# EasyEDA Pro project SWM34SVE.eprj

# Schematic SWM34SVE

## Sheets
1 Core: Create Date: 2023-02-07; Page Name: Core; Project Name: SWM34SVE; Schematic Name: SWM34SVE; Update Date: 2023-07-17; Company: Synwit; Page Size: A4; Version: V1.0
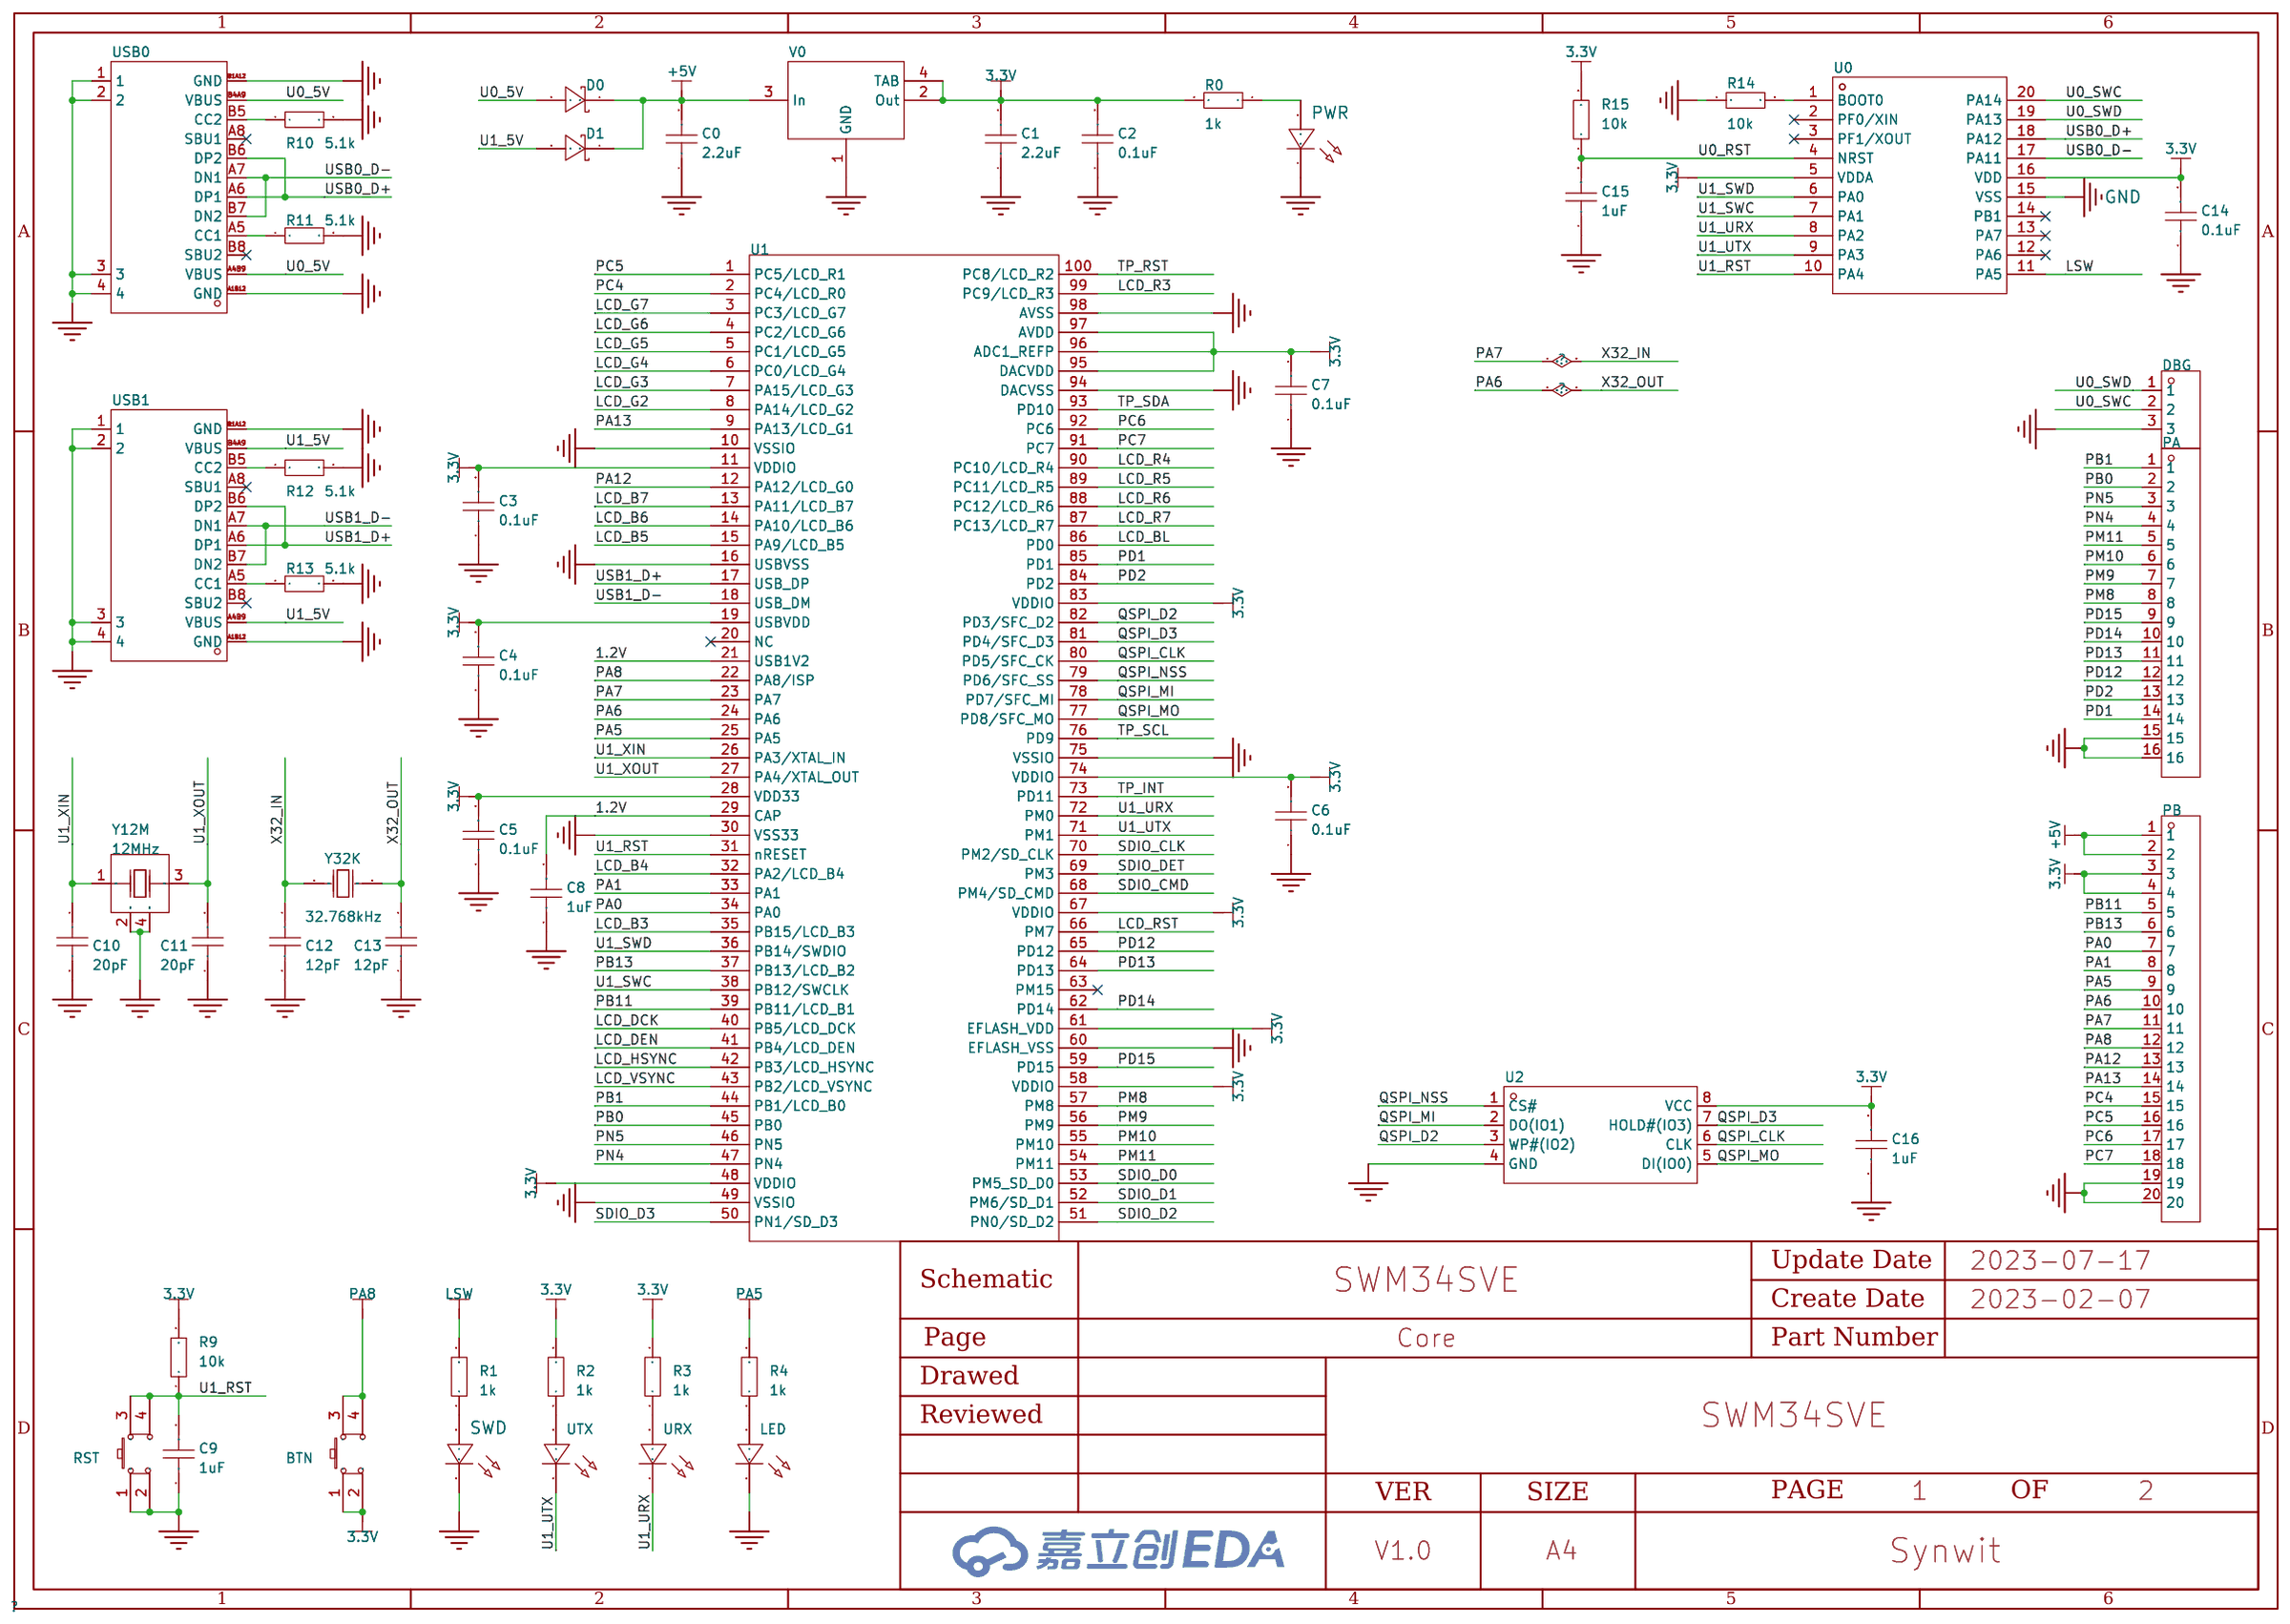
[diagram p0: Core]
2 Other: Page Name: Other; Update Date: 2023-07-14
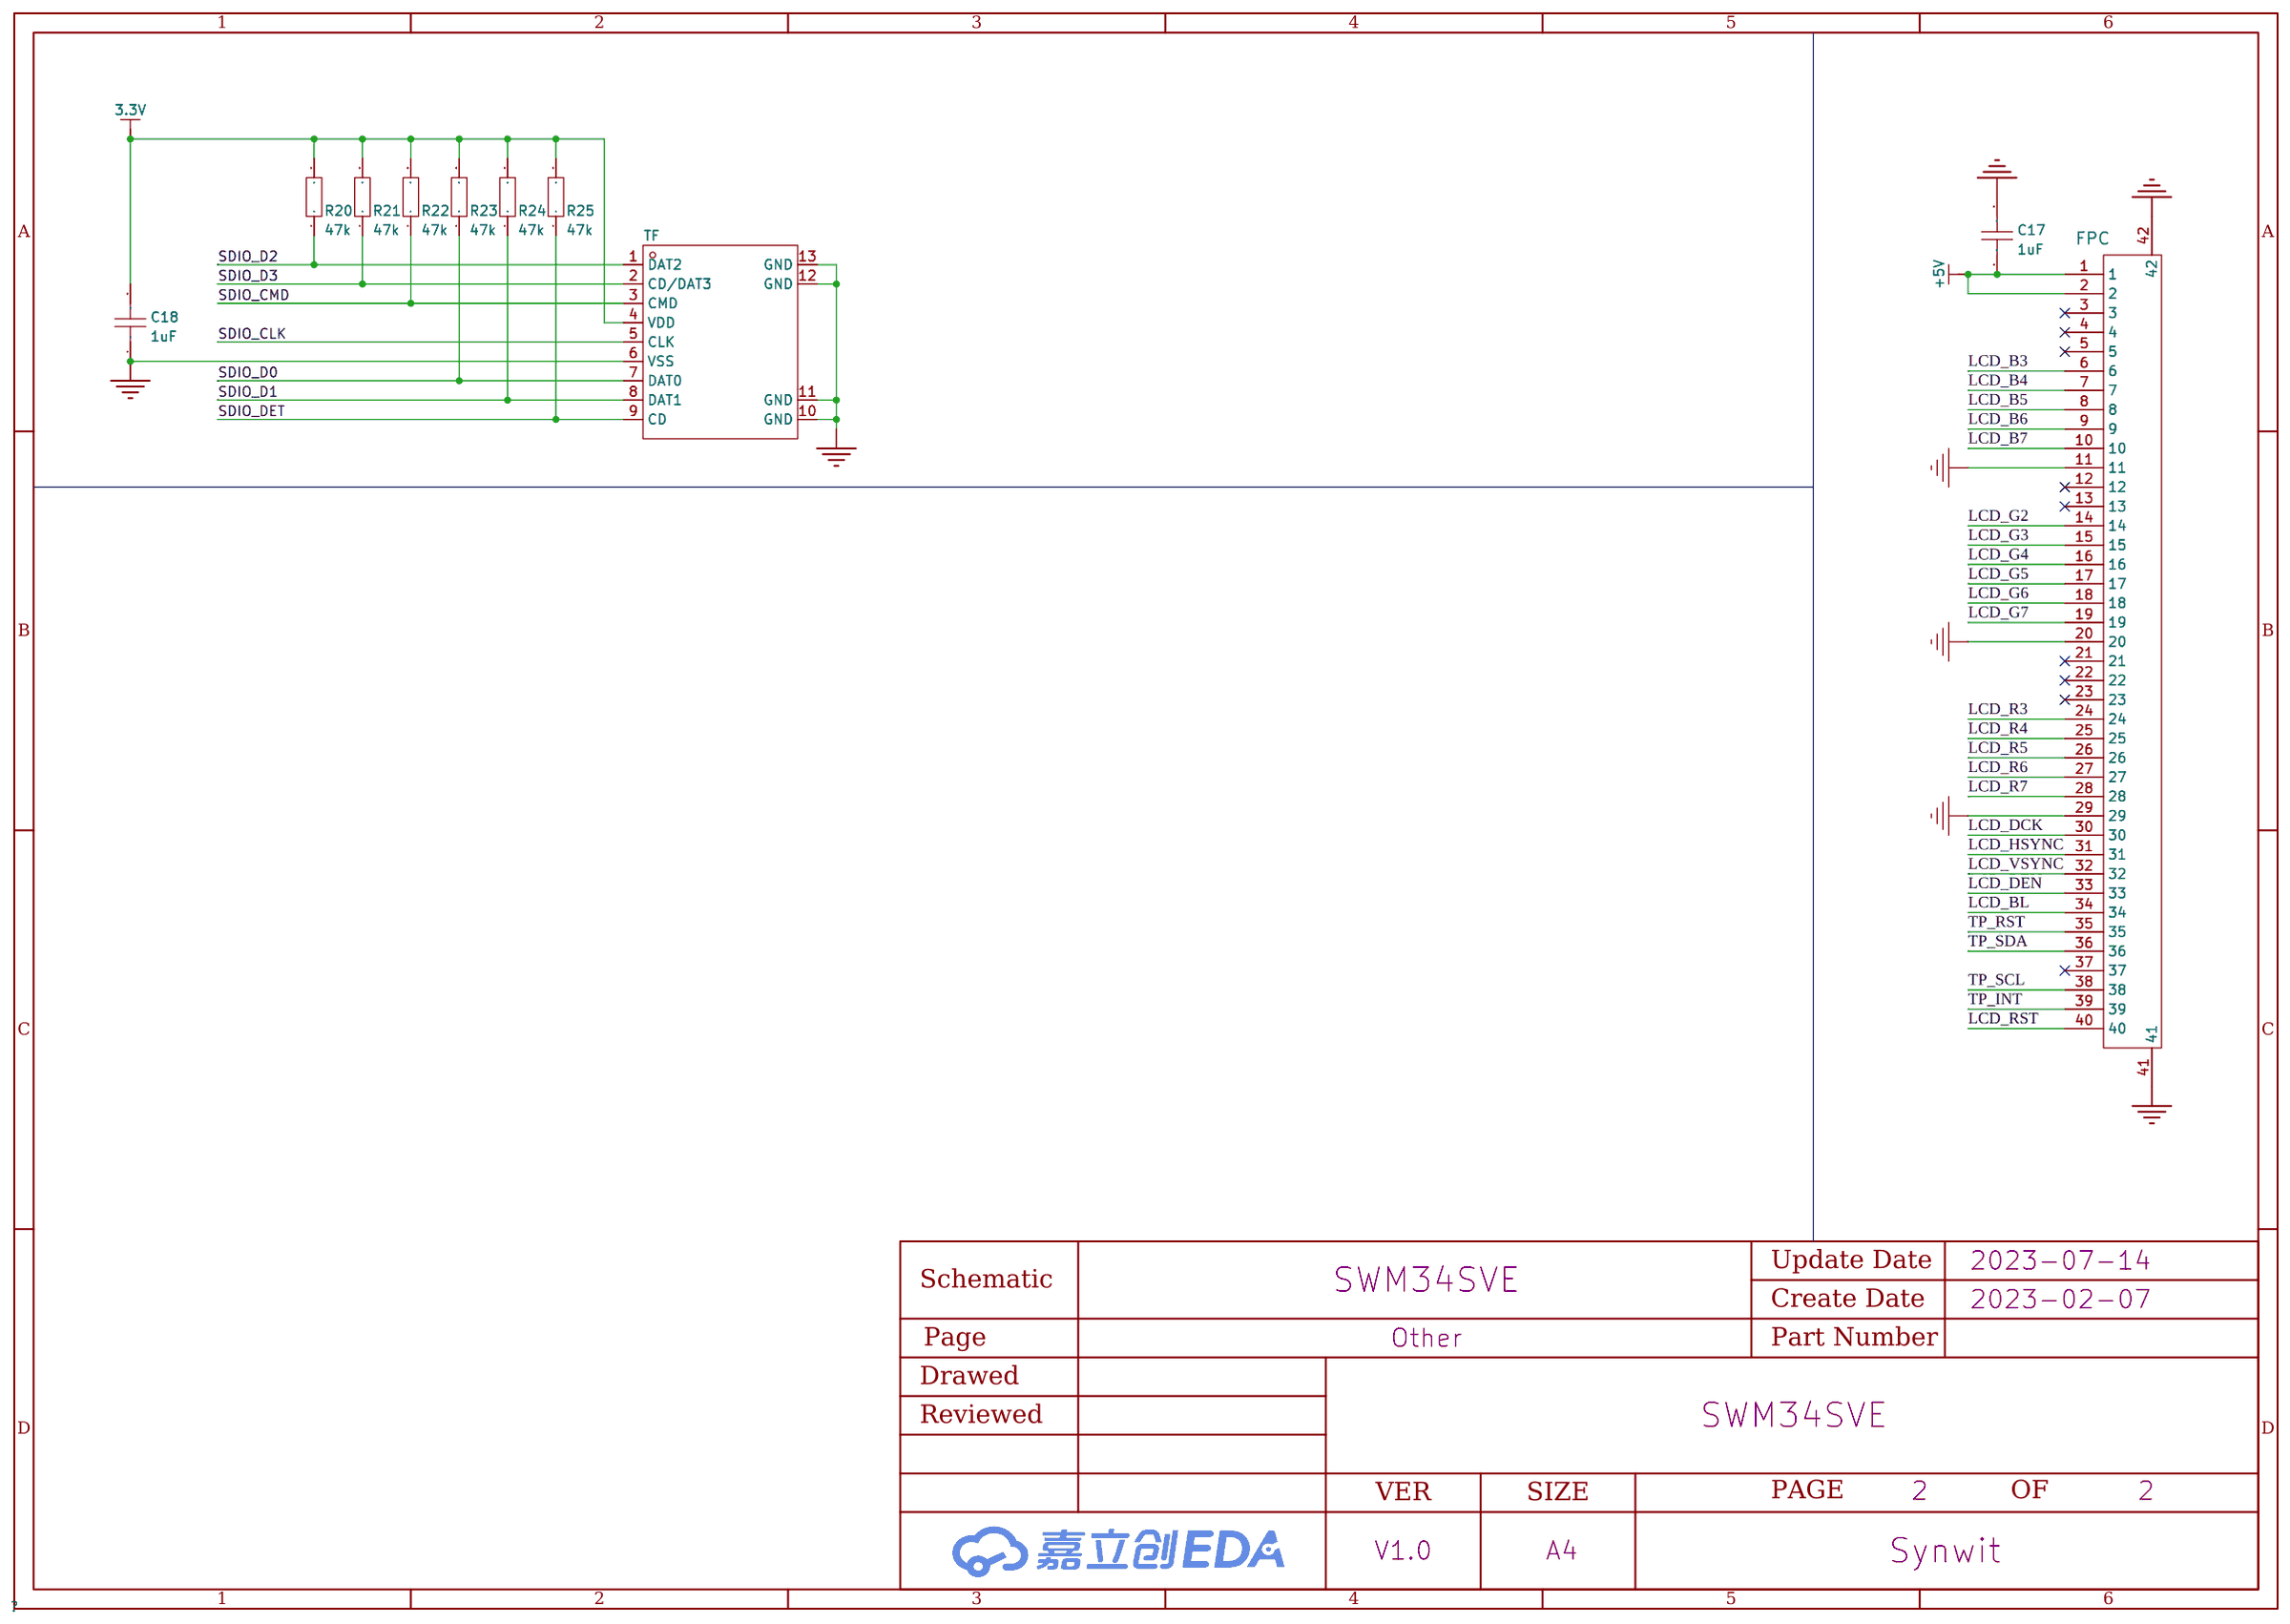
[diagram p1: Other]

## Parts
sheet Core
BTN  PTS815SJK250SMTRLFS  [SW-SMD_4P-L4.2-W3.3-P2.15-LS5.1]
C0  2.2uF  [C0603]
C1  2.2uF  [C0603]
C2  0.1uF  [C0603]
C3  0.1uF  [C0603]
C4  0.1uF  [C0603]
C5  0.1uF  [C0603]
C6  0.1uF  [C0603]
C7  0.1uF  [C0603]
C8  1uF  [C0603]
C9  1uF  [C0603]
C10  20pF  [C0603]
C11  20pF  [C0603]
C12  12pF  [C0603]
C13  12pF  [C0603]
C14  0.1uF  [C0603]
C15  1uF  [C0603]
C16  1uF  [C0603]
D0  1N5818W  [SOD-123FL_L2.8-W1.8-LS3.7-RD]
D1  1N5818W  [SOD-123FL_L2.8-W1.8-LS3.7-RD]
DBG  -  [HDR-TH_3P-P2.54-V-M]
LED  -  [LED0603-RD_BLUE]
PA  -  [HDR-TH_16P-P2.54-V-M]
PB  -  [HDR-TH_20P-P2.54-V-M-1]
PWR  -  [LED0603-RD_BLUE]
R0  1k  [R0603]
R1  1k  [R0603]
R2  1k  [R0603]
R3  1k  [R0603]
R4  1k  [R0603]
R9  10k  [R0603]
R10  5.1k  [R0603]
R11  5.1k  [R0603]
R12  5.1k  [R0603]
R13  5.1k  [R0603]
R14  10k  [R0603]
R15  10k  [R0603]
RST  PTS815SJK250SMTRLFS  [SW-SMD_4P-L4.2-W3.3-P2.15-LS5.1]
SWD  -  [LED0603-RD_BLUE]
U0  -  [TSSOP-20_L6.5-W4.4-P0.65-LS6.4-BL]
U1  -  [LQFP-100_L14.0-W14.0-P0.50-LS16.0-BL]
U2  W25Q64JVSSIQ  [SOIC-8_L5.3-W5.3-P1.27-LS8.0-BL]
URX  -  [LED0603-RD]
USB0  USB-TYPE-C-017  [USB-TYPE-C-SMD_C9900008089]
USB1  USB-TYPE-C-017  [USB-TYPE-C-SMD_C9900008089]
UTX  -  [LED0603-RD]
V0  1117-3.3  [SOT-223-3_L6.4-W3.5-P2.30-LS7.0-BR]
Y12M  12MHz  [OSC-SMD_4P-L3.2-W2.5-BL]
Y32K  32.768kHz  [OSC-SMD_L3.2-W1.5]
sheet Other
C17  1uF  [C0603]
C18  1uF  [C0603]
FPC  AFC01-S40FCA-00  [FPC-SMD_P0.50-40P_FGS-XJ-H2.0]
R20  47k  [R0603]
R21  47k  [R0603]
R22  47k  [R0603]
R23  47k  [R0603]
R24  47k  [R0603]
R25  47k  [R0603]
TF  TF-01  [TF-SMD_TF-02]

## Library data of the parts
BTN RST = PTS815SJK250SMTRLFS: 操作寿命10万次，使用温度-20°C 至 70°C,尺寸4.20mmx3.20mmx2.50mm，操作力度2.5N; LCSC Part Name: 轻触开关; Supplier Part: C918859; Manufacturer: C&K; Supplier Footprint: SMD; JLCPCB Part Class: 扩展库; Datasheet: https://atta.szlcsc.com/upload/public/pdf/source/20190916/C411883_4F77F16E1D8E48DC707D8949CEE7CF80.pdf; Supplier: LCSC
C0-C18 = CAP_0603: 容值:100nF;精度:±10%;额定电压:50V;温度系数:X7R;; Supplier Footprint: 0603
D0 D1 = 1N5818W: 二极管配置:独立式;直流反向耐压(Vr):30V;平均整流电流(Io):1A;正向压降(Vf):875mV@3A;反向电流(Ir):1mA@30V;; LCSC Part Name: 30V 1A 875mV@3A; Supplier Part: C437955; Manufacturer: 晶导微电子; Supplier Footprint: SOD-123FL; JLCPCB Part Class: 扩展库; Datasheet: https://atta.szlcsc.com/upload/public/pdf/source/20191021/C437955_D85247C8F9BBF53ADBACE43A150B0393.pdf; Supplier: LCSC; Diode Configuration: 独立式; Reverse Voltage (Vr): 30V; Average Rectified Current (Io): 1A; Forward Voltage (Vf@If): 875mV@3A; Reverse Leakage Current (Ir): 1mA@30V
DBG = HDR-M_2.54_1x3P: Supplier Part: C2937625; Supplier Footprint: 插件
LED = LED_0603-B: 照明颜色:蓝色;主波长/色坐标:465~475nm;; Supplier Footprint: 0603; Supplier Part: C72041
PA = HDR-M_2.54_1x16P: 间距:2.54mm;总PIN位数:16;排数:1;插针结构:1x16P;行距:-;安装类型:直插;圆针/方针:方针;额定电流:3A;额定电压:-;配合针长度:6mm;塑高:2.5mm;端接针长度:3mm;触头材质:-;工作温度范围:-40~+105;颜色:黑色;; Supplier Part: C2894939; Supplier Footprint: 插件
PB = HDR-M_2.54_1x20P: 间距:2.54mm;总PIN位数:20;排数:1;插针结构:-;行距:-;安装类型:直插;圆针/方针:-;额定电流:-;额定电压:-;配合针长度:-;塑高:-;触头材质:黄铜;触头镀层:-;颜色:黑色;; Supplier Part: C50981; Supplier Footprint: 插件
PWR SWD = LED_0603-R: 发光颜色:红灯;二极管配置:-;透镜颜色:无色透明;主波长:617.5nm;峰值波长:632nm;色温:-;光通量(25时):-;测试电流:5mA;正向电压(VF):2.2V;发光强度:28.5mcd;功率:60mW;发光角度:120°;安装方式:-;工作温度:-40~+85;; Supplier Footprint: 0603; Supplier Part: C72044
R0-R4 R9-R15 R20-R25 = Res_0603: Supplier Footprint: 0603
U0 = AT32F425F8
U1 = SWM34SVE
U2 = W25Q64JVSS: Supplier Part: C179171; Manufacturer: WINBOND(华邦); Supplier Footprint: SOIC-8-208mil; JLCPCB Part Class: 扩展库; Datasheet: https://atta.szlcsc.com/upload/public/pdf/source/20191218/C179171_92C5C91D0324539EDD8F1160D2E79C0F.pdf; Supplier: LCSC
URX UTX = LED_0603-G: 照明颜色:翠绿;色温 - CCT（K）:-;主波长/色坐标:520~535nm;; Supplier Footprint: 0603; Supplier Part: C72043
USB0 USB1 = USB-TYPE-C-017: 连接器类型:Type-C;标准:-;公母:母座;触点数量:16;端口数量:1;安装方式:卧贴;额定电流 - 电源:3A;工作温度范围:-25~+85;; Supplier Part: C2927037; Manufacturer: DEALON(德艺隆); Supplier Footprint: SMD; JLCPCB Part Class: 扩展库; Datasheet: https://atta.szlcsc.com/upload/public/pdf/source/20211217/653222EE5174722C9DFE2966329956D8.pdf; Supplier: LCSC; Connector Type: Type-C; Gender: 母座; Number of Contacts: 16; Number of Ports: 1; Mounting Style: 卧贴; Current Rating - Power (Max): 3A; Operating Temperature Range: -25~+85
V0 = AMS1117-3.3: LCSC Part Name: 三端稳压器; Supplier Part: C5125088; Manufacturer: IDCHIP(英锐芯); Supplier Footprint: SOT-223; JLCPCB Part Class: 扩展库; Datasheet: https://atta.szlcsc.com/upload/public/pdf/source/20220816/063B23F8025063688804E1CFFCDD269A.pdf; Supplier: LCSC
Y12M = X322512MSB4SI: 晶振类型:贴片无源晶振;频率:12MHz;频率公差:±10ppm;频率稳定度:±30ppm;负载电容:20pF;工作温度:-40℃~+85℃;; LCSC Part Name: 12MHz ±10ppm 20pF; Supplier Part: C9002; Manufacturer: YXC(扬兴晶振); Supplier Footprint: SMD3225-4P; JLCPCB Part Class: 基础库; Datasheet: https://atta.szlcsc.com/upload/public/pdf/source/20210329/C112971_1F611BDC486E193C1706F6D8EB5AA189.pdf; Supplier: LCSC; Crystal Type: 贴片无源晶振; Frequency Tolerance: ±10ppm; Frequency Stability: ±30ppm; Load Capacitance: 20pF; Operating Temperature: -40℃~+85℃
Y32K = 7LC32768F12UC: 工作温度:-40℃~+85℃;工作温度:-40℃~+85℃;频率:32.768kHz;负载电容:12.5pF;晶振类型:贴片无源晶振;频率公差:±20ppm;频率公差:±20ppm;等效串联电阻(ESR):70kΩ;; LCSC Part Name: 32.768KHZ 12.5PF  ±20ppm; Supplier Part: C252398; Manufacturer: SJK(晶科鑫); Supplier Footprint: SMD-3215_2P; JLCPCB Part Class: 扩展库; Datasheet: https://atta.szlcsc.com/upload/public/pdf/source/20180725/C252398_B09721EBC402D2F46F4FCA4EBDD60A31.pdf; Supplier: LCSC; Operating Temperature: -40℃~+85℃; Load Capacitance: 12.5pF; Crystal Type: 贴片无源晶振; Frequency Tolerance: ±20ppm; Equivalent Series Resistance (ESR): 70kΩ
FPC = AFC01-S40FCA-00: 间距:0.5mm;触点数量:40;锁定特性:翻盖式;安装类型:卧贴;触点类型:下接;; LCSC Part Name: FPC 0.5MM 40P 翻盖式 H2.0mm 下接; Supplier Part: C262674; Manufacturer: JS(钜硕电子); Supplier Footprint: P=0.5mm; JLCPCB Part Class: 扩展库; Datasheet: https://atta.szlcsc.com/upload/public/pdf/source/20180814/C262674_1AF28B4A53C394BA00EA1A6141614455.pdf; Supplier: LCSC; Pitch: 0.5mm; Number of Contacts: 40; Locking Feature: 翻盖式; Mounting Type: 卧贴; Contact Type: 下接; Height Above Board: 2mm; FFC, FCB Thickness: 0.3mm~0.3mm
TF = TF-01: 卡连接方式:自弹式;卡类型:MicroSD卡(TF卡);连接器类型:卡座;本体最大高度:2mm;工作温度范围:-;; LCSC Part Name: 自弹式 MicroSD卡(TF卡) 卡座 9P外焊 端子镀金; Supplier Part: C2889257; Manufacturer: Yuandi(台湾元迪); Supplier Footprint: SMD; JLCPCB Part Class: 扩展库; Datasheet: https://atta.szlcsc.com/upload/public/pdf/source/20210830/04E8B8B371F2BAAE2FD01F5A99E06D9E.pdf; Supplier: LCSC; Card Connection Mode: 自弹式; Card Type: MicroSD卡(TF卡); Connector Type: 卡座; Maximum Body Height: 2mm

## Nets
1.2V: C8.2 U1.21(USB1V2) U1.29(CAP)
3.3V: BTN.1 BTN.2 C1.2 C2.2 C3.2 C4.2 C5.2 C6.2 C7.2 C14.2 C16.2 C18.2 PB.3 PB.4 R0.2 R2.2 R3.2 R9.2 R15.2 R20.2 R21.2 R22.2 R23.2 R24.2 R25.2 TF.4(VDD) U0.5(VDDA) U0.16(VDD) U1.11(VDDIO) U1.19(USBVDD) U1.28(VDD33) U1.48(VDDIO) U1.58(VDDIO) U1.61(EFLASH_VDD) U1.67(VDDIO) U1.74(VDDIO) U1.83(VDDIO) U1.95(DACVDD) U1.96(ADC1_REFP) U1.97(AVDD) U2.8(VCC) V0.2(Out) V0.4(TAB)
+5V: C0.2 C17.1 D0.1(C) D1.1(C) FPC.1 FPC.2 PB.1 PB.2 V0.3(In)
GND: C0.1 C1.1 C2.1 C3.1 C4.1 C5.1 C6.1 C7.1 C8.1 C9.1 C10.2 C11.1 C12.2 C13.1 C14.1 C15.1 C16.1 C17.2 C18.1 DBG.3 FPC.11 FPC.20 FPC.29 FPC.41 FPC.42 LED.1(C) PA.15 PA.16 PB.19 PB.20 PWR.1(C) R10.2 R11.2 R12.2 R13.2 R14.1 RST.1 RST.2 SWD.1(C) TF.6(VSS) TF.10(GND) TF.11(GND) TF.12(GND) TF.13(GND) U0.15(VSS) U1.10(VSSIO) U1.16(USBVSS) U1.30(VSS33) U1.49(VSSIO) U1.60(EFLASH_VSS) U1.75(VSSIO) U1.94(DACVSS) U1.98(AVSS) U2.4(GND) USB0.1 USB0.2 USB0.3 USB0.4 USB0.A1B12(GND) USB0.B1A12(GND) USB1.1 USB1.2 USB1.3 USB1.4 USB1.A1B12(GND) USB1.B1A12(GND) V0.1(GND) Y12M.2(GND) Y12M.4(GND)
LCD_B3: FPC.6 U1.35(PB15/LCD_B3)
LCD_B4: FPC.7 U1.32(PA2/LCD_B4)
LCD_B5: FPC.8 U1.15(PA9/LCD_B5)
LCD_B6: FPC.9 U1.14(PA10/LCD_B6)
LCD_B7: FPC.10 U1.13(PA11/LCD_B7)
LCD_BL: FPC.34 U1.86(PD0)
LCD_DCK: FPC.30 U1.40(PB5/LCD_DCK)
LCD_DEN: FPC.33 U1.41(PB4/LCD_DEN)
LCD_G2: FPC.14 U1.8(PA14/LCD_G2)
LCD_G3: FPC.15 U1.7(PA15/LCD_G3)
LCD_G4: FPC.16 U1.6(PC0/LCD_G4)
LCD_G5: FPC.17 U1.5(PC1/LCD_G5)
LCD_G6: FPC.18 U1.4(PC2/LCD_G6)
LCD_G7: FPC.19 U1.3(PC3/LCD_G7)
LCD_HSYNC: FPC.31 U1.42(PB3/LCD_HSYNC)
LCD_R3: FPC.24 U1.99(PC9/LCD_R3)
LCD_R4: FPC.25 U1.90(PC10/LCD_R4)
LCD_R5: FPC.26 U1.89(PC11/LCD_R5)
LCD_R6: FPC.27 U1.88(PC12/LCD_R6)
LCD_R7: FPC.28 U1.87(PC13/LCD_R7)
LCD_RST: FPC.40 U1.66(PM7)
LCD_VSYNC: FPC.32 U1.43(PB2/LCD_VSYNC)
LSW: R1.2 U0.11(PA5)
PA0: PB.7 U1.34(PA0)
PA1: PB.8 U1.33(PA1)
PA5: PB.9 R4.2 U1.25(PA5)
PA6: C13.2 PB.10 U1.24(PA6) Y32K.2(OSC2)
PA7: C12.1 PB.11 U1.23(PA7) Y32K.1(OSC1)
PA8: BTN.3 BTN.4 PB.12 U1.22(PA8/ISP)
PA12: PB.13 U1.12(PA12/LCD_G0)
PA13: PB.14 U1.9(PA13/LCD_G1)
PB0: PA.2 U1.45(PB0)
PB1: PA.1 U1.44(PB1/LCD_B0)
PB11: PB.5 U1.39(PB11/LCD_B1)
PB13: PB.6 U1.37(PB13/LCD_B2)
PC4: PB.15 U1.2(PC4/LCD_R0)
PC5: PB.16 U1.1(PC5/LCD_R1)
PC6: PB.17 U1.92(PC6)
PC7: PB.18 U1.91(PC7)
PD1: PA.14 U1.85(PD1)
PD2: PA.13 U1.84(PD2)
PD12: PA.12 U1.65(PD12)
PD13: PA.11 U1.64(PD13)
PD14: PA.10 U1.62(PD14)
PD15: PA.9 U1.59(PD15)
PM8: PA.8 U1.57(PM8)
PM9: PA.7 U1.56(PM9)
PM10: PA.6 U1.55(PM10)
PM11: PA.5 U1.54(PM11)
PN4: PA.4 U1.47(PN4)
PN5: PA.3 U1.46(PN5)
QSPI_CLK: U1.80(PD5/SFC_CK) U2.6(CLK)
QSPI_D2: U1.82(PD3/SFC_D2) U2.3(WP#(IO2))
QSPI_D3: U1.81(PD4/SFC_D3) U2.7(HOLD#(IO3))
QSPI_MI: U1.78(PD7/SFC_MI) U2.2(DO(IO1))
QSPI_MO: U1.77(PD8/SFC_MO) U2.5(DI(IO0))
QSPI_NSS: U1.79(PD6/SFC_SS) U2.1(CS#)
SDIO_CLK: TF.5(CLK) U1.70(PM2/SD_CLK)
SDIO_CMD: R22.1 TF.3(CMD) U1.68(PM4/SD_CMD)
SDIO_D0: R23.1 TF.7(DAT0) U1.53(PM5_SD_D0)
SDIO_D1: R24.1 TF.8(DAT1) U1.52(PM6/SD_D1)
SDIO_D2: R20.1 TF.1(DAT2) U1.51(PN0/SD_D2)
SDIO_D3: R21.1 TF.2(CD/DAT3) U1.50(PN1/SD_D3)
SDIO_DET: R25.1 TF.9(CD) U1.69(PM3)
TP_INT: FPC.39 U1.73(PD11)
TP_RST: FPC.35 U1.100(PC8/LCD_R2)
TP_SCL: FPC.38 U1.76(PD9)
TP_SDA: FPC.36 U1.93(PD10)
U0_5V: D0.2(A) USB0.A4B9(VBUS) USB0.B4A9(VBUS)
U0_RST: C15.2 R15.1 U0.4(NRST)
U0_SWC: DBG.2 U0.20(PA14)
U0_SWD: DBG.1 U0.19(PA13)
U1_5V: D1.2(A) USB1.A4B9(VBUS) USB1.B4A9(VBUS)
U1_RST: C9.2 R9.1 RST.3 RST.4 U0.10(PA4) U1.31(nRESET)
U1_SWC: U0.7(PA1) U1.38(PB12/SWCLK)
U1_SWD: U0.6(PA0) U1.36(PB14/SWDIO)
U1_URX: U0.8(PA2) U1.72(PM0) URX.1(C)
U1_UTX: U0.9(PA3) U1.71(PM1) UTX.1(C)
U1_XIN: C10.1 U1.26(PA3/XTAL_IN) Y12M.1(OSC1)
U1_XOUT: C11.2 U1.27(PA4/XTAL_OUT) Y12M.3(OSC2)
USB0_D+: U0.18(PA12) USB0.A6(DP1) USB0.B6(DP2)
USB0_D-: U0.17(PA11) USB0.A7(DN1) USB0.B7(DN2)
USB1_D+: U1.17(USB_DP) USB1.A6(DP1) USB1.B6(DP2)
USB1_D-: U1.18(USB_DM) USB1.A7(DN1) USB1.B7(DN2)
$1N5592: R11.1 USB0.A5(CC1)
$1N5593: R10.1 USB0.B5(CC2)
$1N5603: PWR.2(A) R0.1
$1N5607: R13.1 USB1.A5(CC1)
$1N5608: R12.1 USB1.B5(CC2)
$1N5726: R2.1 UTX.2(A)
$1N5728: R1.1 SWD.2(A)
$1N5730: R3.1 URX.2(A)
$1N5736: LED.2(A) R4.1
$1N5816: R14.2 U0.1(BOOT0)

Not connected (* = marked no-connect by the designer): FPC 3* 4* 5* 12* 13* 21* 22* 23* 37*; U0 2(PF0/XIN)* 3(PF1/XOUT)* 12(PA6)* 13(PA7)* 14(PB1)*; U1 20(NC)* 63(PM15)*; USB0 A8(SBU1)* B8(SBU2)*; USB1 A8(SBU1)* B8(SBU2)*

# Board SWM34SVE
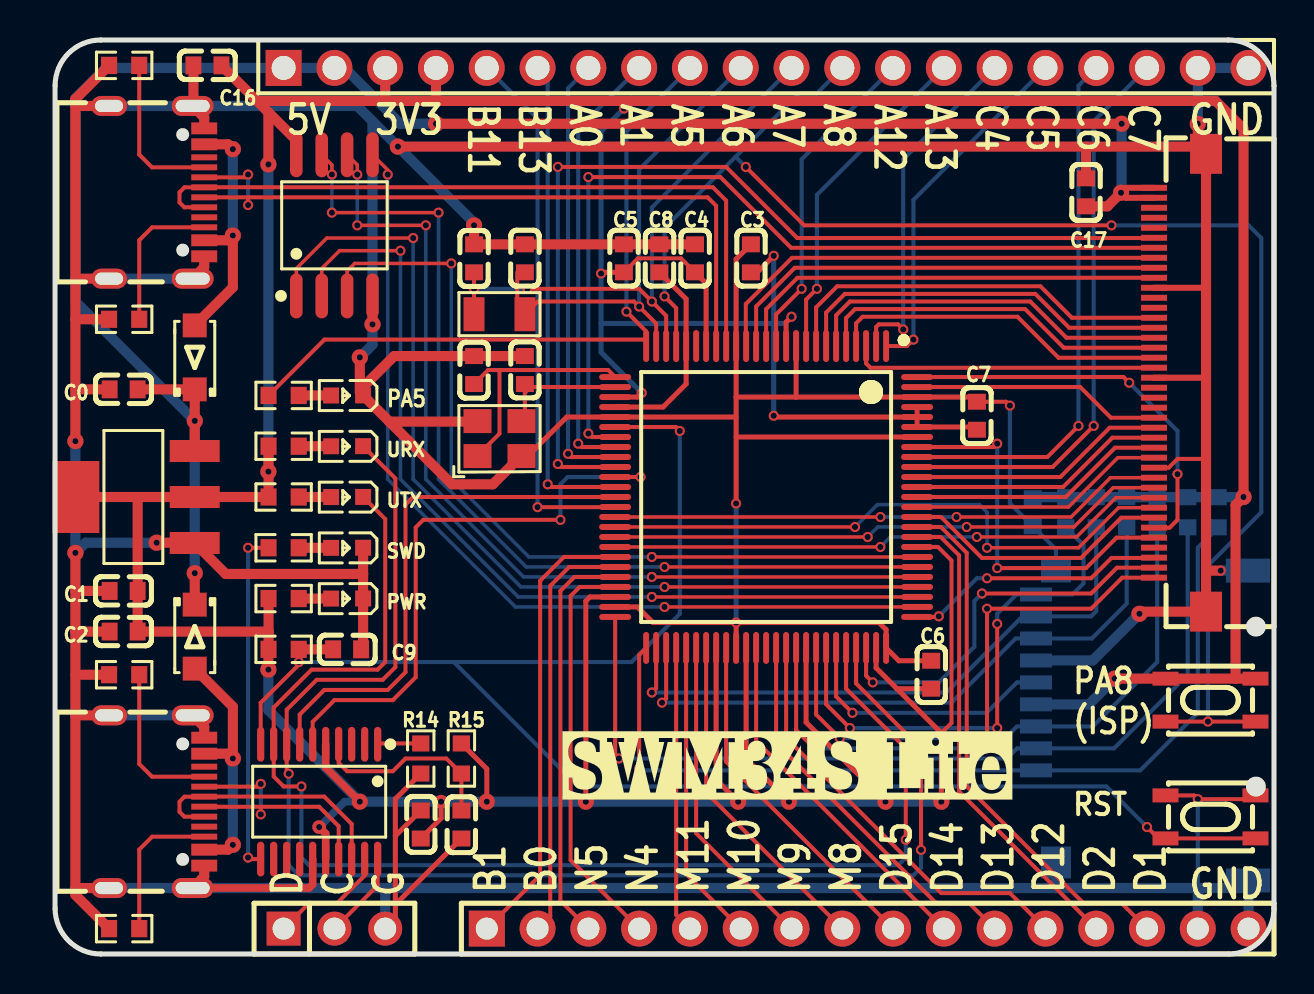
[diagram p2: board, top side]
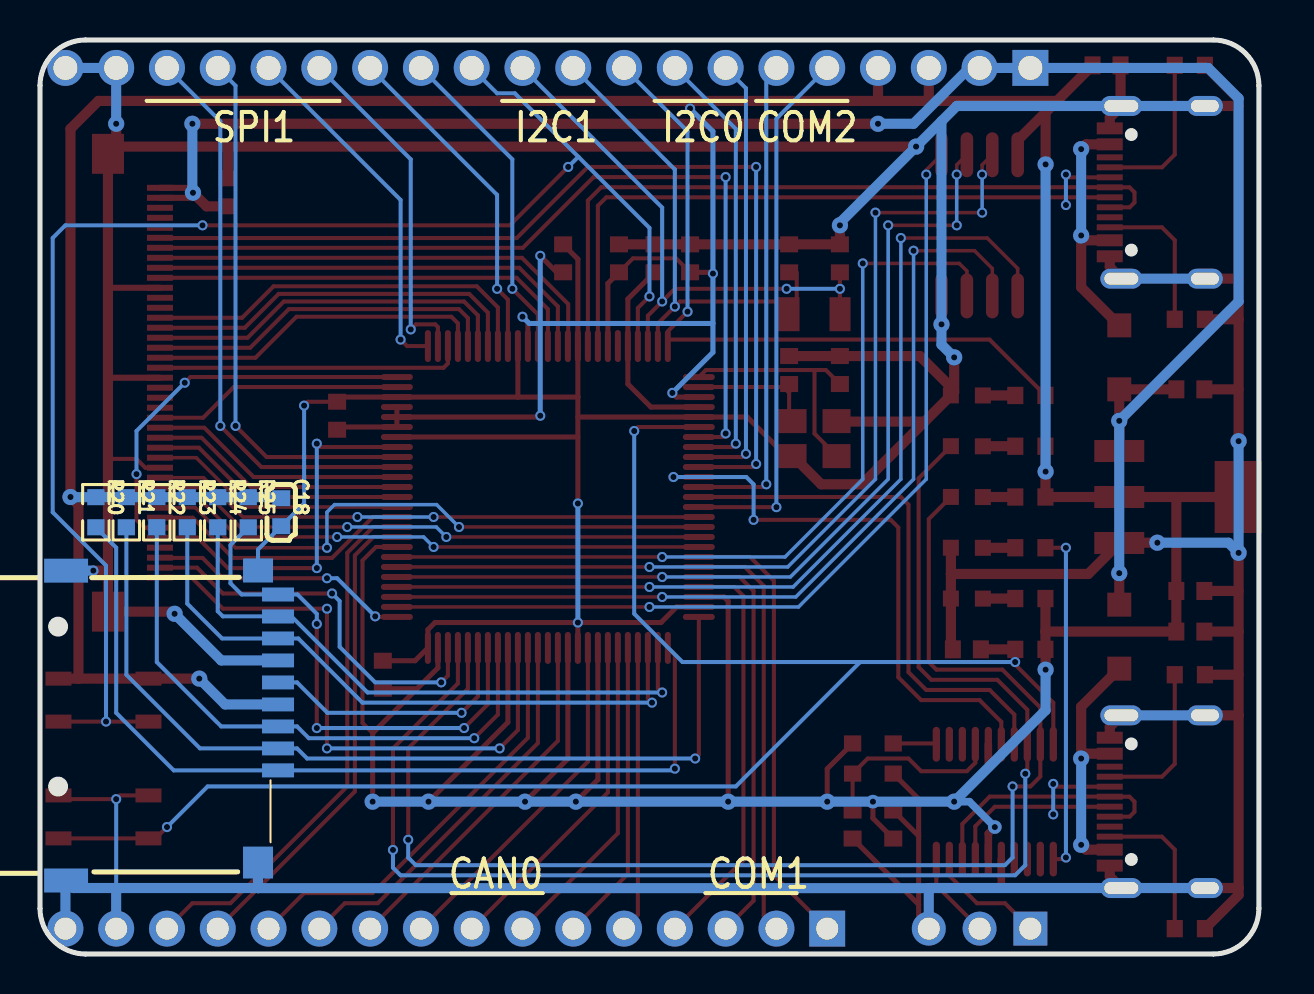
[diagram p3: board, bottom side, seen from below]

Outline 60.96 x 45.72 mm; copper layers: Top Layer, Bottom Layer. Coordinates in mm from the lower left corner of the outline.
Outline path: 0,43.43 0,2.29 arc(0.67,0.67) 2.29,0 58.67,0 arc(60.29,0.67) 60.96,2.29 60.96,43.43 arc(60.29,45.05) 58.67,45.72 2.29,45.72 arc(0.67,45.05) 0,43.43
Stack: Top Layer 0.035mm / Dielectric1 1.51mm FR4 er 4.5 / Bottom Layer 0.035mm

## Design rules (mm)
spacing safeClearance (default): track to track 0.152, other pairs 0.152 to 0.3
track width trackWidth (default): min 0.178, default 0.203, max 0.508
differential pair differentialPair (default): width min 0.127, default 0.254, max 2.54; gap min 0.152, default 0.152
via viaSize (default): diameter min 0.508, default 0.559, max 0.813; hole min 0.305, default 0.305, max 0.305

## Placement (name value [footprint] x y rotation side)
BTN  PTS815SJK250SMTRLFS  [SW-SMD_4P-L4.2-W3.3-P2.15-LS5.1]  57.78 12.7 0 top
C0  2.2uF  [C0603]  3.43 28.25 0 top
C1  2.2uF  [C0603]  3.43 18.16 0 top
C2  0.1uF  [C0603]  3.43 16.13 0 top
C3  0.1uF  [C0603]  34.8 34.8 270 top
C4  0.1uF  [C0603]  32 34.8 270 top
C5  0.1uF  [C0603]  28.45 34.8 270 top
C6  0.1uF  [C0603]  43.81 13.97 270 top
C7  0.1uF  [C0603]  46.1 26.92 270 top
C8  1uF  [C0603]  30.23 34.8 270 top
C9  1uF  [C0603]  14.6 15.24 180 top
C10  20pF  [C0603]  20.96 29.21 90 top
C11  20pF  [C0603]  23.5 29.21 270 top
C12  12pF  [C0603]  20.96 34.8 90 top
C13  12pF  [C0603]  23.5 34.8 270 top
C14  0.1uF  [C0603]  18.29 6.48 270 top
C15  1uF  [C0603]  20.32 6.48 90 top
C16  1uF  [C0603]  7.62 44.45 0 top
C17  1uF  [C0603]  51.56 38.1 90 top
C18  1uF  [C0603]  48.9 22.1 90 bottom
D0  1N5818W  [SOD-123FL_L2.8-W1.8-LS3.7-RD]  6.98 15.88 270 top
D1  1N5818W  [SOD-123FL_L2.8-W1.8-LS3.7-RD]  6.98 29.84 90 top
DBG  -  [HDR-TH_3P-P2.54-V-M]  13.97 1.27 0 top
FPC  AFC01-S40FCA-00  [FPC-SMD_P0.50-40P_FGS-XJ-H2.0]  56.26 28.58 270 top
LED  -  [LED0603-RD_BLUE]  14.6 27.94 180 top
PA  -  [HDR-TH_16P-P2.54-V-M]  40.64 1.27 0 top
PB  -  [HDR-TH_20P-P2.54-V-M-1]  35.56 44.32 0 top
PWR  -  [LED0603-RD_BLUE]  14.6 17.78 180 top
R0  1k  [R0603]  11.43 17.78 180 top
R1  1k  [R0603]  11.43 20.32 180 top
R2  1k  [R0603]  11.43 22.86 180 top
R3  1k  [R0603]  11.43 25.4 180 top
R4  1k  [R0603]  11.43 27.94 180 top
R9  10k  [R0603]  11.43 15.24 180 top
R10  5.1k  [R0603]  3.45 1.27 180 top
R11  5.1k  [R0603]  3.45 13.97 180 top
R12  5.1k  [R0603]  3.45 31.75 180 top
R13  5.1k  [R0603]  3.45 44.45 180 top
R14  10k  [R0603]  18.29 9.78 90 top
R15  10k  [R0603]  20.32 9.78 90 top
R20  47k  [R0603]  58.17 22.1 90 bottom
R21  47k  [R0603]  56.64 22.1 90 bottom
R22  47k  [R0603]  55.12 22.1 90 bottom
R23  47k  [R0603]  53.59 22.1 90 bottom
R24  47k  [R0603]  52.07 22.1 90 bottom
R25  47k  [R0603]  50.55 22.1 90 bottom
RST  PTS815SJK250SMTRLFS  [SW-SMD_4P-L4.2-W3.3-P2.15-LS5.1]  57.78 6.86 0 top
SWD  -  [LED0603-RD_BLUE]  14.6 20.32 180 top
TF  TF-01  [TF-SMD_TF-02]  54.36 11.43 270 bottom
U0  -  [TSSOP-20_L6.5-W4.4-P0.65-LS6.4-BL]  13.21 7.62 180 top
U1  -  [LQFP-100_L14.0-W14.0-P0.50-LS16.0-BL]  35.56 22.86 180 top
U2  W25Q64JVSSIQ  [SOIC-8_L5.3-W5.3-P1.27-LS8.0-BL]  13.97 36.45 0 top
URX  -  [LED0603-RD]  14.6 25.4 180 top
USB0  USB-TYPE-C-017  [USB-TYPE-C-SMD_C9900008089]  5.08 7.62 270 top
USB1  USB-TYPE-C-017  [USB-TYPE-C-SMD_C9900008089]  5.08 38.1 270 top
UTX  -  [LED0603-RD]  14.6 22.86 180 top
V0  1117-3.3  [SOT-223-3_L6.4-W3.5-P2.30-LS7.0-BR]  4.01 22.86 0 top
Y12M  12MHz  [OSC-SMD_4P-L3.2-W2.5-BL]  22.22 25.78 0 top
Y32K  32.768kHz  [OSC-SMD_L3.2-W1.5]  22.22 32 0 top

## Footprints (pads in the part's own frame, mm; a bottom-side part is the same pattern mirrored in y, then rotated)
C0603
  rect 0.8x0.9 smd: 1(-0.7,0) 2(0.7,0)
FPC-SMD_P0.50-40P_FGS-XJ-H2.0
  rect 0.3x1.3 smd: 1(-9.75,-1.3) 2(-9.25,-1.3) 3(-8.75,-1.3) 4(-8.25,-1.3) 5(-7.75,-1.3) 6(-7.25,-1.3) 7(-6.75,-1.3) 8(-6.25,-1.3) 9(-5.75,-1.3) 10(-5.25,-1.3) 11(-4.75,-1.3) 12(-4.25,-1.3) 13(-3.75,-1.3) 14(-3.25,-1.3) 15(-2.75,-1.3) 16(-2.25,-1.3) 17(-1.75,-1.3) 18(-1.25,-1.3) 19(-0.75,-1.3) 20(-0.25,-1.3) 21(0.25,-1.3) 22(0.75,-1.3) 23(1.25,-1.3) 24(1.75,-1.3) 25(2.25,-1.3) 26(2.75,-1.3) 27(3.25,-1.3) 28(3.75,-1.3) 29(4.25,-1.3) 30(4.75,-1.3) 31(5.25,-1.3) 32(5.75,-1.3) 33(6.25,-1.3) 34(6.75,-1.3) 35(7.25,-1.3) 36(7.75,-1.3) 37(8.25,-1.3) 38(8.75,-1.3) 39(9.25,-1.3) 40(9.75,-1.3)
  rect 2x1.6 smd: 41(11.45,1.3) 42(-11.45,1.3)
HDR-TH_3P-P2.54-V-M
  rect 1.7x1.7 hole 1.1: 1(-2.54,0)
  round 1.7 hole 1.1: 2(0,0) 3(2.54,0)
HDR-TH_16P-P2.54-V-M
  rect 1.801x1.801 hole 1.1: 1(-19.05,0)
  round 1.801 hole 1.1: 2(-16.51,0) 3(-13.97,0) 4(-11.43,0) 5(-8.89,0) 6(-6.35,0) 7(-3.81,0) 8(-1.27,0) 9(1.27,0) 10(3.81,0) 11(6.35,0) 12(8.89,0) 13(11.43,0) 14(13.97,0) 15(16.51,0) 16(19.05,0)
HDR-TH_20P-P2.54-V-M-1
  rect 1.801x1.801 hole 1.199: 1(-24.13,0)
  round 1.801 hole 1.199: 2(-21.59,0) 3(-19.05,0) 4(-16.51,0) 5(-13.97,0) 6(-11.43,0) 7(-8.89,0) 8(-6.35,0) 9(-3.81,0) 10(-1.27,0) 11(1.27,0) 12(3.81,0) 13(6.35,0) 14(8.89,0) 15(11.43,0) 16(13.97,0) 17(16.51,0) 18(19.05,0) 19(21.59,0) 20(24.13,0)
LED0603-RD
  rect 0.8x0.8 smd: 1(-0.799,-0.004) 2(0.799,0.004)
LED0603-RD_BLUE
  rect 0.8x0.8 smd: 1(-0.8,-0.003) 2(0.8,0.003)
LQFP-100_L14.0-W14.0-P0.50-LS16.0-BL
  oval 0.3x1.6 smd: 1(-6,-7.55) 2(-5.5,-7.55) 3(-5,-7.55) 4(-4.5,-7.55) 5(-4,-7.55) 6(-3.5,-7.55) 7(-3,-7.55) 8(-2.5,-7.55) 9(-2,-7.55) 10(-1.5,-7.55) 11(-1,-7.55) 12(-0.5,-7.55) 13(0,-7.55) 14(0.5,-7.55) 15(1,-7.55) 16(1.5,-7.55) 17(2,-7.55) 18(2.5,-7.55) 19(3,-7.55) 20(3.5,-7.55) 21(4,-7.55) 22(4.5,-7.55) 23(5,-7.55) 24(5.5,-7.55) 25(6,-7.55) 51(6,7.55) 52(5.5,7.55) 53(5,7.55) 54(4.5,7.55) 55(4,7.55) 56(3.5,7.55) 57(3,7.55) 58(2.5,7.55) 59(2,7.55) 60(1.5,7.55) 61(1,7.55) 62(0.5,7.55) 63(0,7.55) 64(-0.5,7.55) 65(-1,7.55) 66(-1.5,7.55) 67(-2,7.55) 68(-2.5,7.55) 69(-3,7.55) 70(-3.5,7.55) 71(-4,7.55) 72(-4.5,7.55) 73(-5,7.55) 74(-5.5,7.55) 75(-6,7.55)
  oval 1.6x0.3 smd: 26(7.55,-6) 27(7.55,-5.5) 28(7.55,-5) 29(7.55,-4.5) 30(7.55,-4) 31(7.55,-3.5) 32(7.55,-3) 33(7.55,-2.5) 34(7.55,-2) 35(7.55,-1.5) 36(7.55,-1) 37(7.55,-0.5) 38(7.55,0) 39(7.55,0.5) 40(7.55,1) 41(7.55,1.5) 42(7.55,2) 43(7.55,2.5) 44(7.55,3) 45(7.55,3.5) 46(7.55,4) 47(7.55,4.5) 48(7.55,5) 49(7.55,5.5) 50(7.55,6) 76(-7.55,6) 77(-7.55,5.5) 78(-7.55,5) 79(-7.55,4.5) 80(-7.55,4) 81(-7.55,3.5) 82(-7.55,3) 83(-7.55,2.5) 84(-7.55,2) 85(-7.55,1.5) 86(-7.55,1) 87(-7.55,0.5) 88(-7.55,0) 89(-7.55,-0.5) 90(-7.55,-1) 91(-7.55,-1.5) 92(-7.55,-2) 93(-7.55,-2.5) 94(-7.55,-3) 95(-7.55,-3.5) 96(-7.55,-4) 97(-7.55,-4.5) 98(-7.55,-5) 99(-7.55,-5.5) 100(-7.55,-6)
OSC-SMD_4P-L3.2-W2.5-BL
  rect 1.4x1.2 smd: 1(-1.1,-0.875) 2(1.1,-0.875) 3(1.1,0.875) 4(-1.1,0.875)
OSC-SMD_L3.2-W1.5
  rect 1.05x1.7 smd: 1(-1.275,0) 2(1.275,0)
R0603
  rect 0.806x0.864 smd: 1(-0.753,0) 2(0.753,0)
SOD-123FL_L2.8-W1.8-LS3.7-RD
  rect 1.2x1.2 smd: 1(-1.6,0) 2(1.6,0)
SOIC-8_L5.3-W5.3-P1.27-LS8.0-BL
  oval 0.63x2.25 smd: 1(-1.905,-3.53) 2(-0.635,-3.53) 3(0.635,-3.53) 4(1.905,-3.53) 5(1.905,3.53) 6(0.635,3.53) 7(-0.635,3.53) 8(-1.905,3.53)
SOT-223-3_L6.4-W3.5-P2.30-LS7.0-BR
  rect 2.5x1.1 smd: 1(2.97,-2.3) 2(2.97,0) 3(2.97,2.3)
  rect 2.34x3.6 smd: 4(-2.97,0)
SW-SMD_4P-L4.2-W3.3-P2.15-LS5.1
  rect 1.3x0.701 smd: 1(-2.251,1.075) 2(2.251,1.075) 3(-2.251,-1.075) 4(2.251,-1.075)
TF-SMD_TF-02
  rect 0.7x1.6 smd: 1(2.245,5.3) 2(1.145,5.3) 3(0.046,5.3) 4(-1.054,5.3) 5(-2.155,5.3) 6(-3.255,5.3) 7(-4.354,5.3) 8(-5.454,5.3) 9(-6.554,5.3)
  rect 1.2x1.5 smd: 10(-7.754,4.3)
  rect 1.2x2.2 smd: 11(-7.746,-5.3) 12(7.754,-5.3)
  rect 1.6x1.5 smd: 13(6.854,4.3)
TSSOP-20_L6.5-W4.4-P0.65-LS6.4-BL
  oval 0.364x1.742 smd: 1(-2.925,-2.871) 2(-2.275,-2.871) 3(-1.625,-2.871) 4(-0.975,-2.871) 5(-0.325,-2.871) 6(0.325,-2.871) 7(0.975,-2.871) 8(1.625,-2.871) 9(2.275,-2.871) 10(2.925,-2.871) 11(2.925,2.871) 12(2.275,2.871) 13(1.625,2.871) 14(0.975,2.871) 15(0.325,2.871) 16(-0.325,2.871) 17(-0.975,2.871) 18(-1.625,2.871) 19(-2.275,2.871) 20(-2.925,2.871)
USB-TYPE-C-SMD_C9900008089
  oval 1x2.1 hole 0.6x1.7: 1(-4.32,1.801) 2(4.32,1.801)
  oval 1x1.8 hole 0.6x1.4: 3(-4.32,-2.379) 4(4.32,-2.379)
  rect 0.6x1.3 smd: A1B12(-3.2,2.379) A4B9(-2.4,2.379) B1A12(3.2,2.379) B4A9(2.4,2.379)
  rect 0.3x1.3 smd: A5(-1.25,2.379) A6(-0.25,2.379) A7(0.25,2.379) A8(1.25,2.379) B5(1.75,2.379) B6(0.75,2.379) B7(-0.75,2.379) B8(-1.75,2.379)

## Nets
As in the schematic.

Pads without a net: FPC 3 4 5 12 13 21 22 23 37; U0 2 3 12 13 14; U1 20 63; USB0 A8 B8; USB1 A8 B8

## Via types
v1: diameter 0.508, hole 0.305, Top Layer to Bottom Layer, 93 vias
v2: diameter 0.813, hole 0.305, Top Layer to Bottom Layer, 30 vias
v3: diameter 0.686, hole 0.305, Top Layer to Bottom Layer, 2 vias

## Routing (per net, layer and track width the routed paths; a pad name or vN(x,y) marks a point on that pad's centre or on a via; arc(x,y) is an arc through that point)
1.2V: length 10.2
  Top Layer w0.254: U1.29 30.41,27.36 31.56,28.51 U1.21 31.56,32.76 C8.2
3.3V: length 325.1
  Top Layer w0.203: 44.32,11.05 44.83,11.56 44.83,19.69 44.16,20.36 U1.83 ; C4.2 31.3,34.8 29.15,34.8 C5.2
  Top Layer w0.254: U1.48 26.75,17.86 26.54,17.65 v2(26.54,7.62) ; U1.74 41.06,14.31 42.1,13.27 ; U1.96 U1.95 45.97,26.36 C7.2 ; U1.96 36,26.86 v1(35.94,26.92) ; U1.96 U1.97 ; U1.67 37.56,11.59 v2(41.53,7.62) ; R15.2 21.59,9.26 v2(21.59,7.62) ; C3.2 35.11,34.1 v1(35.94,34.92) ; v2(36.7,7.62) 34.56,9.76 U1.61 ; v1(36.83,31.88) 36.56,31.61 U1.11 ; C6.2 42.1,13.27 ; 42.1,13.27 44.32,11.05 44.32,7.67 ; v1(27.31,34.04) 27.37,34.1 C5.2 ; U1.28 29.13,27.86 v1(29.34,28.07) ; v2(34.16,7.62) 33.06,8.72 U1.58 ; v1(28.45,42.29) 28.83,42.67 ; U1.19 32.56,33.54 C4.2 ; v3(19.3,7.62) 19.3,6.79 C14.2
  Top Layer w0.381: U0.5 13.53,9.33 v2(15.24,7.62) ; 13.53,4.75 13.53,6.03 v3(13.21,6.35)
  Top Layer w0.508: 10.68,24.08 R2.2 V0.2 V0.4 ; 10.68,24.08 R3.2 ; 10.68,24.08 10.67,24.09 v2(10.67,24.13) ; PB.4 19.05,42.67 ; 10.1,42.67 10.67,42.1 ; 10.1,42.67 C16.2 ; 10.1,42.67 16.52,42.67 ; 10.67,42.1 12.06,40.7 U2.8 ; 10.67,42.1 v2(10.67,39.5) ; 10.68,16.12 R9.2 10.67,15.23 v2(10.67,14.22) ; 10.68,16.12 10.67,16.13 C2.2 C1.2 4.13,22.86 ; 10.68,16.12 R0.2 ; 59.04,13.77 BTN.1 v2(52.99,13.77) ; 59.04,13.77 BTN.2 ; 59.04,13.77 59.04,22.46 v2(59.44,22.86) 59.44,41.28 58.04,42.67 16.52,42.67 ; PB.3 16.51,42.68 16.52,42.67 ; v2(44.32,7.62) 44.32,7.67
  Bottom Layer w0.254: 27.31,31.54 v1(27.31,34.04) 27.31,41.15 v1(28.45,42.29) ; 27.31,31.54 27.31,30.1 v1(29.34,28.07) ; 27.31,31.54 35.94,31.54 ; v1(36.83,31.88) 36.49,31.54 35.94,31.54 ; v1(35.94,34.92) 35.94,31.54 ; 35.94,31.54 v1(35.94,26.92)
  Bottom Layer w0.381: v3(13.21,6.35) 14.48,7.62 v2(15.24,7.62)
  Bottom Layer w0.508: v2(44.32,7.62) v2(41.53,7.62) v2(36.7,7.62) v2(34.16,7.62) v2(26.54,7.62) v2(21.59,7.62) v3(19.3,7.62) v2(15.24,7.62) 10.67,12.19 v2(10.67,14.22) ; C18.2 48.95,22.85 R25.2 R24.2 R23.2 R22.2 R21.2 R20.2 59.43,22.85 v2(59.44,22.86) ; TF.4 51.7,12.48 v2(52.99,13.77) ; v2(10.67,24.13) v2(10.67,39.5)
+5V: length 96.9
  Top Layer w0.305: FPC.1 53.56,38.33 v2(53.31,38.08) 53.56,37.83 FPC.2
  Top Layer w0.508: D0.1 v2(6.98,19.05) ; v2(53.34,41.53) v2(19.05,41.53) ; C17.1 52.63,37.4 v2(53.31,38.08) ; C0.2 D1.1 v2(6.98,26.67) V0.3
  Bottom Layer w0.508: v2(53.31,38.08) 53.34,38.11 v2(53.34,41.53) ; v2(19.05,41.53) 17.27,41.53 14.48,44.32 PB.2 PB.1 2.54,44.32 1.02,42.8 1.02,32.64 v2(6.98,26.67) v2(6.98,19.05)
GND: length 439.3
  Top Layer w0.203: v1(47.75,27.43) 47.56,27.62 C7.1 ; FPC.29 55.69,24.33 56.13,24.77 57.56,24.77 ; RST.1 56.96,7.93 v1(57.15,7.75) 59.64,7.75
  Top Layer w0.254: v1(34.06,16.58) U1.60 ; v1(34.06,16.58) 41.21,16.58 41.56,16.22 U1.75 42.2,14.67 C6.1 ; v1(34.06,16.58) 29.9,16.58 29.12,17.36 U1.49 ; R14.1 17.02,7.76 17.02,5.91 ; C7.1 45.87,27.86 U1.98 37.06,27.86 ; C14.1 17.02,5.91 ; 17.02,5.91 17.02,2.47 ; C15.1 17.02,2.47 ; 17.02,2.47 17.02,1.78 DBG.3 ; 34.06,27.86 U1.16 34.06,34.76 C3.1 ; 34.06,27.86 34.06,27.86 37.06,27.86 ; 34.06,27.86 v1(34.06,22.54) ; 23.32,24.93 23.66,24.93 25.59,26.86 U1.30 34.06,26.86 ; U1.10 37.06,27.86 37.06,27.86 ; U1.94 34.06,25.86
  Top Layer w0.305: FPC.20 57.56,28.83 ; FPC.11 57.56,33.33
  Top Layer w0.381: 6.88,3.3 12.7,3.3 12.88,3.48 12.88,4.75
  Top Layer w0.508: v2(57.15,41.53) 57.15,40.44 57.2,40.39 ; 23.32,24.93 21.89,23.5 19.85,23.5 16.72,26.63 ; USB1.3 1.02,42.42 1.02,42.42 ; USB1.4 1.02,33.78 ; 1.02,3.29 1.02,2.95 R10.2 ; 1.02,3.29 1.02,11.94 ; 1.02,3.29 1.02,3.3 USB0.4 ; C16.1 6.92,42.46 USB1.1 7.46,41.84 USB1.A1B12 ; 1.02,16.13 1.02,16.13 C2.1 ; 1.02,16.13 1.02,11.94 ; 1.02,16.13 v2(1.02,20.07) ; C0.1 1.02,28.25 ; 15.41,19.01 PWR.1 15.41,15.34 C9.1 ; 15.41,19.01 SWD.1 ; 15.41,19.01 8.53,19.01 V0.1 6.97,20.57 v2(5.08,20.57) ; USB0.B1A12 7.46,3.88 USB0.2 ; C11.1 C10.2 16.96,29.91 15.41,28.36 LED.1 ; LED.1 15.24,28.11 v2(15.24,29.84) ; LED.1 16.72,26.63 ; USB0.A1B12 7.46,11.36 USB0.1 ; C17.2 51.56,40.39 ; 21.12,26.63 16.72,26.63 ; USB1.2 7.46,34.36 USB1.B1A12 ; v2(54.23,17.02) 54.34,17.12 FPC.41 FPC.42 57.2,40.39 ; C1.1 1.02,18.16 ; R11.2 1.02,13.97 ; 1.02,11.94 1.02,11.94 USB0.3 ; 57.2,40.39 v2(17.15,40.39) ; C4.1 C8.1 C5.1 C13.1 C12.2 v2(20.96,36.45) ; R13.2 1.02,42.77 1.02,42.42 ; v1(58.29,19.18) 57.56,19.18 ; v2(1.02,25.65) 1.02,31.75 ; 1.02,31.75 1.02,42.42 ; 1.02,31.75 R12.2 ; v2(15.88,31.5) U2.4
  Bottom Layer w0.203: TF.10 50.06,20.24 C18.1 47.75,22.54 v1(47.75,27.43) ; v1(57.15,7.75) 57.15,3.3
  Bottom Layer w0.254: v1(34.06,16.58) v1(34.06,22.54)
  Bottom Layer w0.508: 57.16,3.3 57.15,3.29 PA.15 ; 57.16,3.3 59.28,3.3 TF.12 59.69,3.64 PA.16 ; 57.16,3.3 50.05,3.3 ; USB0.4 USB0.2 16.5,3.3 16.51,3.29 ; TF.13 50.06,3.3 50.05,3.3 ; USB1.3 USB1.1 15.11,42.42 15.88,41.66 ; 16.51,3.29 50.05,3.29 50.05,3.3 ; 16.51,3.29 DBG.3 ; 15.88,41.66 v2(17.15,40.39) 20.96,36.58 v2(20.96,36.45) ; 15.88,41.66 v2(15.88,31.5) 15.88,30.48 v2(15.24,29.84) ; v2(1.02,25.65) v2(1.02,20.07) 1.52,20.57 v2(5.08,20.57) ; PB.20 PB.19 v2(57.15,41.53) ; USB1.2 USB1.4 ; v1(58.29,19.18) TF.11 ; TF.6 51.9,14.68 v2(54.23,17.02) ; USB0.1 USB0.3
LCD_B3: length 49.1
  Top Layer w0.203: U1.35 25.3,24.36 v1(25.15,24.51) ; v1(25.15,39.37) 33.56,39.37 37.12,35.81 54.95,35.81 FPC.6
  Bottom Layer w0.203: v1(25.15,39.37) v1(25.15,24.51)
LCD_B4: length 44
  Top Layer w0.203: FPC.7 36.81,35.33 33.27,38.86 v1(26.67,38.86) ; v1(26.67,26.03) 26.84,25.86 U1.32
  Bottom Layer w0.203: v1(26.67,26.03) v1(26.67,38.86)
LCD_B5: length 23.5
  Top Layer w0.203: FPC.8 36.86,34.83 34.54,32.51 34.54,30.43 U1.15
LCD_B6: length 22.7
  Top Layer w0.203: FPC.9 36.99,34.33 35.06,32.39 U1.14
LCD_B7: length 21.9
  Top Layer w0.203: FPC.10 37.13,33.83 35.56,32.26 U1.13
LCD_BL: length 13.5
  Top Layer w0.203: U1.86 44.31,21.86 46.35,19.81 51.31,19.81 53.32,21.83 FPC.34
LCD_DCK: length 27.8
  Top Layer w0.178: FPC.30 52.78,23.83 50.82,21.86 v1(45.09,21.86) ; U1.40 v1(41.28,21.86)
  Bottom Layer w0.178: v1(41.28,21.86) v1(45.09,21.86)
LCD_DEN: length 30.2
  Top Layer w0.178: v1(46.61,20.32) 51.18,20.32 53.19,22.33 FPC.33 ; v1(40,21.36) U1.41
  Bottom Layer w0.178: v1(46.61,20.32) 46.61,22.1 46.23,22.48 41.12,22.48 v1(40,21.36)
LCD_G2: length 19.9
  Top Layer w0.203: FPC.14 50.85,31.83 49.28,33.4 39.12,33.4 38.06,32.34 U1.8
LCD_G3: length 19.2
  Top Layer w0.203: U1.7 38.56,32.08 39.5,33.02 49.02,33.02 50.72,31.33 FPC.15
LCD_G4: length 18.5
  Top Layer w0.203: U1.6 39.06,31.95 39.75,32.64 48.77,32.64 50.58,30.83 FPC.16
LCD_G5: length 17.8
  Top Layer w0.203: U1.5 39.56,31.81 40,32.26 48.51,32.26 50.45,30.33 FPC.17
LCD_G6: length 17
  Top Layer w0.203: U1.4 40.06,31.55 40.39,31.88 48.13,31.88 50.19,29.83 FPC.18
LCD_G7: length 15.4
  Top Layer w0.203: FPC.19 40.78,29.33 40.56,29.54 U1.3
LCD_HSYNC: length 28
  Top Layer w0.178: FPC.31 52.92,23.33 50.95,21.36 v1(45.59,21.36) ; v1(40.64,20.86) U1.42
  Bottom Layer w0.178: v1(45.59,21.36) 41.14,21.36 v1(40.64,20.86)
LCD_R3: length 12.5
  Top Layer w0.203: FPC.24 52.8,26.83 51.27,28.36 U1.99
LCD_R4: length 12.9
  Top Layer w0.203: FPC.25 52.74,26.33 50.28,23.86 U1.90
LCD_R5: length 12.9
  Top Layer w0.203: U1.89 50.41,23.36 52.88,25.83 FPC.26
LCD_R6: length 12.9
  Top Layer w0.203: U1.88 50.55,22.86 53.01,25.33 FPC.27
LCD_R7: length 12.9
  Top Layer w0.178: FPC.28 53.15,24.83 50.68,22.36 U1.87
LCD_RST: length 30
  Top Layer w0.203: v1(37.97,10.29) 37.06,11.2 U1.66 ; v1(46.61,10.29) v1(46.61,17.27) 51.82,17.27 53.37,18.83 FPC.40
  Bottom Layer w0.203: v1(37.97,10.29) v1(46.61,10.29)
LCD_VSYNC: length 28
  Top Layer w0.178: FPC.32 53.05,22.83 51.09,20.86 v1(46.1,20.86) ; v1(41.28,20.36) U1.43
  Bottom Layer w0.178: v1(46.1,20.86) 41.78,20.86 v1(41.28,20.36)
LSW: length 17.2
  Top Layer w0.203: 10.28,4.75 9.73,4.75 v1(9.65,4.83) ; v1(9.65,20.32) R1.2
  Bottom Layer w0.203: v1(9.65,20.32) v1(9.65,4.83)
PA0: length 22.1
  Top Layer w0.203: v1(25.65,25.02) 25.81,24.86 U1.34
  Bottom Layer w0.203: v1(25.65,25.02) 25.65,43.31 PB.7
PA1: length 22
  Top Layer w0.203: v1(26.16,25.53) 26.33,25.36 U1.33
  Bottom Layer w0.203: PB.8 26.16,41.28 v1(26.16,25.53)
PA5: length 35.7
  Top Layer w0.203: 29.56,30.74 29.56,30.73 13.47,30.73 R4.2 ; 29.56,30.74 U1.25 ; 29.56,30.74 29.56,31.15 v1(28.57,32.13)
  Bottom Layer w0.203: PB.9 28.57,41.15 v1(28.57,32.13)
PA6: length 24.5
  Top Layer w0.203: Y32K.2 24.13,32.64 28.96,32.64 v1(29.21,32.39) 30.06,31.53 U1.24 ; 23.11,34.1 23.11,32.01 23.12,32
  Bottom Layer w0.203: PB.10 29.21,39.24 v1(29.21,32.39)
PA7: length 28.4
  Top Layer w0.203: U1.23 30.56,31.92 v1(29.84,32.64) 29.21,33.27 v1(23.62,33.27) ; Y32K.1 20.96,32.01 v1(20.96,33.27) C12.1
  Bottom Layer w0.203: v1(23.62,33.27) v1(20.96,33.27) ; PB.11 29.84,37.34 v1(29.84,32.64)
PA8: length 76.1
  Top Layer w0.203: v1(30.48,32.89) 31.06,32.31 U1.22 ; BTN.3 BTN.4 ; v1(52.83,36.45) 37.47,36.45 v1(34.54,39.37)
  Bottom Layer w0.203: v1(34.54,39.37) 34.04,39.88 34.04,39.88 ; PB.12 38.1,43.05 37.21,43.05 34.04,39.88 ; 34.04,39.88 30.48,36.32 v1(30.48,32.89) ; v1(52.83,36.45) 59.69,36.45 60.32,35.81 60.32,22.1 57.66,19.43 v1(57.66,11.63)
PA12: length 16.3
  Top Layer w0.203: U1.12 36.06,32 v1(37.34,33.27)
  Bottom Layer w0.203: v1(37.34,33.27) 37.34,39.75 PB.13
PA13: length 16.8
  Top Layer w0.203: U1.9 37.56,32.73 v1(38.1,33.27)
  Bottom Layer w0.203: v1(38.1,33.27) 38.1,37.97 PB.14
PB0: length 21
  Top Layer w0.203: PA.2 24.76,1.91 24.76,18.42 25.71,19.36 U1.45
PB1: length 22.8
  Top Layer w0.203: U1.44 25.45,19.86 24.26,18.67 24.26,3.94 PA.1
PB11: length 26.9
  Top Layer w0.203: v1(24.13,22.35) 28,22.35 U1.39
  Bottom Layer w0.203: v1(24.13,22.35) 24.13,41.78 PB.5
PB13: length 24.5
  Top Layer w0.203: v1(24.64,23.5) 24.77,23.36 U1.37
  Bottom Layer w0.203: v1(24.64,23.5) 24.64,43.81 PB.6
PC4: length 17.4
  Top Layer w0.203: v1(42.42,31.24) 42.16,31.5 41.19,31.5 41.06,31.36 U1.2
  Bottom Layer w0.203: PB.15 42.42,39.75 v1(42.42,31.24)
PC5: length 17.8
  Top Layer w0.203: U1.1 42.6,30.41 v1(42.93,30.73)
  Bottom Layer w0.203: v1(42.93,30.73) 42.93,37.72 PB.16
PC6: length 27
  Top Layer w0.203: v1(51.18,26.42) 49.62,24.86 U1.92
  Bottom Layer w0.203: PB.17 51.18,43.43 v1(51.18,26.42)
PC7: length 28.7
  Top Layer w0.203: U1.91 49.89,24.36 v1(51.94,26.42)
  Bottom Layer w0.203: PB.18 51.94,41.66 v1(51.94,26.42)
PD1: length 26.7
  Top Layer w0.203: U1.85 44.3,21.36 45.59,20.07 45.59,8.38 51.44,2.54 53.34,2.54 PA.14
PD2: length 24
  Top Layer w0.203: U1.84 44.29,20.86 45.21,19.94 45.21,8.13 PA.13
PD12: length 21.4
  Top Layer w0.203: PA.12 47.75,3.05 44.32,3.05 36.56,10.81 U1.65
PD13: length 19.5
  Top Layer w0.203: U1.64 36.06,10.55 44.07,2.54 45.72,2.54 PA.11
PD14: length 17.9
  Top Layer w0.203: U1.62 35.06,10.66 PA.10
PD15: length 17.5
  Top Layer w0.203: U1.59 33.56,9.62 PA.9
PM8: length 16.9
  Top Layer w0.203: U1.57 32.56,8.08 PA.8
PM9: length 16
  Top Layer w0.203: PA.7 32.06,6.04 U1.56
PM10: length 15.2
  Top Layer w0.203: U1.55 31.56,4 PA.6
PM11: length 14.3
  Top Layer w0.203: U1.54 31.06,1.96 PA.5
PN4: length 20.5
  Top Layer w0.203: PA.4 25.78,4.7 25.78,17.91 26.23,18.36 U1.47
PN5: length 20.5
  Top Layer w0.203: PA.3 25.27,2.67 25.27,18.16 25.97,18.86 U1.46
QSPI_CLK: length 46.5
  Top Layer w0.178: U2.6 15.11,39.47 v1(15.11,38.99) ; U1.80 v1(29.84,18.86) ; v1(18.54,36.45) v1(15.11,36.45)
  Bottom Layer w0.178: v1(29.84,18.86) 23.43,18.86 18.54,23.75 v1(18.54,36.45) ; v1(15.11,36.45) v1(15.11,38.99)
QSPI_D2: length 42.3
  Top Layer w0.178: U1.82 v1(29.84,19.86) ; v1(19.81,34.54) 14.99,34.54 14.6,34.16 U2.3
  Bottom Layer w0.178: v1(29.84,19.86) 23.7,19.86 19.81,23.75 v1(19.81,34.54)
QSPI_D3: length 47.5
  Top Layer w0.178: v1(13.84,37.08) v1(19.18,37.08) ; U1.81 v1(30.48,19.36) ; v1(13.84,38.99) 13.84,39.47 U2.7
  Bottom Layer w0.178: v1(30.48,19.36) 23.57,19.36 19.18,23.75 v1(19.18,37.08) ; v1(13.84,37.08) v1(13.84,38.99)
QSPI_MI: length 45.4
  Top Layer w0.178: U2.2 13.34,34.29 14.22,35.18 v1(17.27,35.18) ; U1.78 v1(29.84,17.86)
  Bottom Layer w0.178: v1(17.27,35.18) 17.27,23.75 23.16,17.86 v1(29.84,17.86)
QSPI_MO: length 45.7
  Top Layer w0.178: v1(16.64,38.99) 16.64,39.22 U2.5 ; U1.77 v1(30.48,17.36)
  Bottom Layer w0.178: v1(30.48,17.36) 23.03,17.36 16.64,23.75 v1(16.64,38.99)
QSPI_NSS: length 47.3
  Top Layer w0.178: U1.79 v1(30.48,18.36) ; v1(17.91,35.81) 13.59,35.81 12.06,34.29 U2.1
  Bottom Layer w0.178: v1(17.91,35.81) 17.91,23.75 23.3,18.36 v1(30.48,18.36)
SDIO_CLK: length 13.4
  Top Layer w0.203: U1.70 39.06,12.88 v1(39.88,12.06)
  Bottom Layer w0.203: v1(39.88,12.06) 46.58,12.06 48.1,13.58 TF.5
SDIO_CMD: length 29.2
  Top Layer w0.203: U1.68 38.06,11.98 v1(39.24,10.8)
  Bottom Layer w0.203: v1(39.24,10.8) 47.51,10.8 48.1,11.38 TF.3 51.9,11.38 55.12,14.61 R22.1
SDIO_D0: length 31.9
  Top Layer w0.203: U1.53 30.56,12.78 v1(30.35,12.57)
  Bottom Layer w0.203: v1(30.35,12.57) 44.83,12.57 48.04,15.78 TF.7 51.85,15.78 53.59,17.53 R23.1
SDIO_D1: length 30.4
  Top Layer w0.203: U1.52 30.06,13.3 v1(29.84,13.08)
  Bottom Layer w0.203: R24.1 52.07,17.14 51.82,16.89 49.06,16.89 TF.8 48.38,16.88 44.58,13.08 v1(29.84,13.08)
SDIO_D2: length 45.1
  Top Layer w0.203: U1.51 29.21,14.96 v1(29.21,9.27)
  Bottom Layer w0.203: R20.1 57.15,20.33 57.15,12.06 54.27,9.19 TF.1 29.3,9.19 v1(29.21,9.27)
SDIO_D3: length 44.7
  Top Layer w0.203: v1(28.19,9.78) 28.01,9.96 U1.50
  Bottom Layer w0.203: R21.1 56.64,13.97 52.96,10.29 49.06,10.29 TF.2 48.1,10.28 47.6,9.78 v1(28.19,9.78)
SDIO_DET: length 25.7
  Top Layer w0.203: v1(47.12,11.3) v1(47.12,16.51) ; U1.69 38.56,12.49 v1(39.75,11.3)
  Bottom Layer w0.203: R25.1 51.44,20.46 51.44,18.54 50.88,17.98 TF.9 48.08,17.98 47.12,17.02 v1(47.12,16.51) ; v1(39.75,11.3) v1(47.12,11.3)
TP_INT: length 19.6
  Top Layer w0.203: v1(46.35,18.03) 51.82,18.03 53.11,19.33 FPC.39 ; v1(40.89,13.59) 40.56,13.92 U1.73
  Bottom Layer w0.203: v1(46.35,18.03) 45.97,17.65 45.97,15.37 44.2,13.59 v1(40.89,13.59)
TP_RST: length 19.9
  Top Layer w0.203: v1(56.13,24) 56.13,21.72 55.74,21.33 FPC.35 ; U1.100 53.44,28.86 v1(53.72,28.58)
  Bottom Layer w0.203: v1(53.72,28.58) 56.13,26.16 v1(56.13,24)
TP_SCL: length 13.1
  Top Layer w0.203: v1(44.2,16.89) 44.16,16.86 U1.76 ; FPC.38 54.95,19.81 52.83,19.81 51.82,18.8 v1(46.61,18.8)
  Bottom Layer w0.203: v1(46.61,18.8) 46.1,18.8 v1(44.2,16.89)
TP_SDA: length 18.8
  Top Layer w0.203: FPC.36 54.96,20.83 53.09,20.83 51.56,19.3 v1(47.12,19.3) ; v1(47.12,25.53) 46.95,25.36 U1.93
  Bottom Layer w0.203: v1(47.12,25.53) v1(47.12,19.3)
U0_5V: length 12.7
  Top Layer w0.508: USB0.A4B9 8.65,10.02 v2(8.89,9.78) 8.89,12.37 D0.2 ; v2(8.89,5.46) 8.65,5.22 USB0.B4A9
  Bottom Layer w0.508: v2(8.89,5.46) v2(8.89,9.78)
U0_RST: length 9.7
  Top Layer w0.203: C15.2 R15.1 19.57,9.78 17.53,9.78 16.89,9.14 14.6,9.14 14.18,9.57 U0.4
U0_SWC: length 4.4
  Top Layer w0.203: DBG.2 16.13,3.43 16.13,4.75
U0_SWD: length 6
  Top Layer w0.203: 15.48,4.75 15.48,3.93 14.1,2.54 12.7,2.54 DBG.1
U1_5V: length 12.7
  Top Layer w0.508: USB1.B4A9 8.65,35.7 v2(8.89,35.94) 8.89,33.35 D1.2 ; USB1.A4B9 8.65,40.5 v2(8.89,40.26)
  Bottom Layer w0.508: v2(8.89,35.94) v2(8.89,40.26)
U1_RST: length 83.5
  Top Layer w0.203: v1(12.19,14.61) 12.18,14.6 ; 12.18,14.6 12.18,14.47 10.28,12.57 U0.10 ; 12.18,14.6 R9.1 ; RST.4 RST.3 55.18,5.78 v1(54.61,6.35) ; v1(31.24,26.16) 31.04,26.36 U1.31
  Top Layer w0.508: R9.1 C9.2
  Bottom Layer w0.203: 19.94,14.61 28.83,14.61 31.24,17.02 v1(31.24,26.16) ; 19.94,14.61 26.16,8.38 52.58,8.38 v1(54.61,6.35) ; 19.94,14.61 v1(12.19,14.61)
U1_SWC: length 26.7
  Top Layer w0.203: U1.38 17.91,22.86 17.53,22.48 17.53,14.1 16.64,13.21 13.46,13.21 12.23,11.98 U0.7
U1_SWD: length 29.3
  Top Layer w0.203: v1(25.27,21.72) 18.41,21.72 18.03,21.34 18.03,13.84 16.89,12.7 13.97,12.7 12.88,11.61 U0.6 ; U1.36 v1(29.28,23.86)
  Bottom Layer w0.203: v1(29.28,23.86) 25.64,23.86 25.27,23.5 v1(25.27,21.72)
U1_URX: length 70.2
  Top Layer w0.203: U1.72 40.06,13.53 43.31,10.29 v1(43.31,5.21) ; v1(11.68,9.02) 11.58,9.12 U0.8 11.58,12.22 13.08,13.72 16.38,13.72 17.02,14.35 17.02,23.79 URX.1
  Bottom Layer w0.203: v1(43.31,5.21) 43.31,4.32 42.93,3.94 12.19,3.94 11.68,4.44 v1(11.68,9.02)
U1_UTX: length 66.1
  Top Layer w0.203: v1(42.54,5.72) 42.54,10.29 39.56,13.27 U1.71 ; UTX.1 16.51,21.76 16.51,14.61 16.13,14.22 12.83,14.22 10.93,12.33 U0.9 10.93,8.88 11.43,8.38 v1(12.32,8.38)
  Bottom Layer w0.203: v1(42.54,5.72) 42.54,4.83 42.16,4.44 12.7,4.44 12.32,4.83 v1(12.32,8.38)
U1_XIN: length 12.2
  Top Layer w0.203: C10.1 21.66,29.21 22.22,29.21 ; U1.26 27.66,29.21 22.22,29.21 ; 22.22,29.21 22.22,29.21 22.22,26.03 21.12,24.93
U1_XOUT: length 6.6
  Top Layer w0.203: 23.32,26.63 23.5,26.8 23.5,28.07 ; 23.5,28.07 23.78,28.36 U1.27 ; 23.5,28.07 C11.2
USB0_D+: length 12.9
  Top Layer w0.203: USB0.B6 6.47,6.87 6.22,7.11 6.22,7.62 6.47,7.87 USB0.A6 7.46,7.87 13.46,7.87 14.83,6.5 14.83,4.75
USB0_D-: length 13.6
  Top Layer w0.203: 14.18,4.75 14.18,6.39 13.21,7.37 7.46,7.37 USB0.A7 ; v1(10.29,6.98) 10.29,7.37 ; v1(10.29,8.51) 10.15,8.37 USB0.B7
  Bottom Layer w0.203: v1(10.29,8.51) v1(10.29,6.98)
USB1_D+: length 36.8
  Top Layer w0.203: USB1.B6 6.47,37.35 6.22,37.59 6.22,38.1 6.47,38.35 USB1.A6 7.46,38.35 32.89,38.35 33.56,37.69 U1.17
USB1_D-: length 37
  Top Layer w0.203: USB1.A7 32.63,37.85 33.06,37.42 U1.18 ; USB1.B7 9.51,38.85 v1(9.65,38.99) ; v1(9.65,37.47) 9.65,37.85
  Bottom Layer w0.203: v1(9.65,38.99) v1(9.65,37.47)
$1N5592: length 8
  Top Layer w0.203: USB0.A5 4.85,8.87 4.21,9.51 R11.1
$1N5593: length 7.5
  Top Layer w0.203: USB0.B5 4.85,5.87 4.21,5.22 R10.1
$1N5603: length 1.6
  Top Layer w0.508: R0.1 13.8,17.78 PWR.2
$1N5607: length 8
  Top Layer w0.203: USB1.A5 4.85,39.35 4.21,39.99 R13.1
$1N5608: length 7.5
  Top Layer w0.203: USB1.B5 4.85,36.35 4.21,35.7 R12.1
$1N5726: length 1.6
  Top Layer w0.508: UTX.2 13.8,22.86 R2.1
$1N5728: length 1.6
  Top Layer w0.508: SWD.2 13.8,20.32 R1.1
$1N5730: length 1.6
  Top Layer w0.508: R3.1 13.8,25.4 URX.2
$1N5736: length 1.6
  Top Layer w0.508: LED.2 13.8,27.94 R4.1
$1N5816: length 2.2
  Top Layer w0.203: U0.1 16.17,10.53 R14.2

## Text on the board
Bottom Silkscreen Layer: COM2 | COM1 | I2C0 | I2C1 | CAN0 | SPI1
Top Silkscreen Layer: PA5 | PA8 / (ISP) | 5V | 3V3 | GND | D | C | G | B1 | B0 | N5 | N4 | M11 | M10 | M9 | M8 | D15 | D14 | D13 | D12 | D2 | D1 | B11 | B13 | A0 | A1 | A5 | A6 | A7 | A8 | A12 | A13 | C4 | C5 | C6 | C7 | SWM34S Lite
